# EAGLE design LOA_Legba (EAGLE 7.6.0)
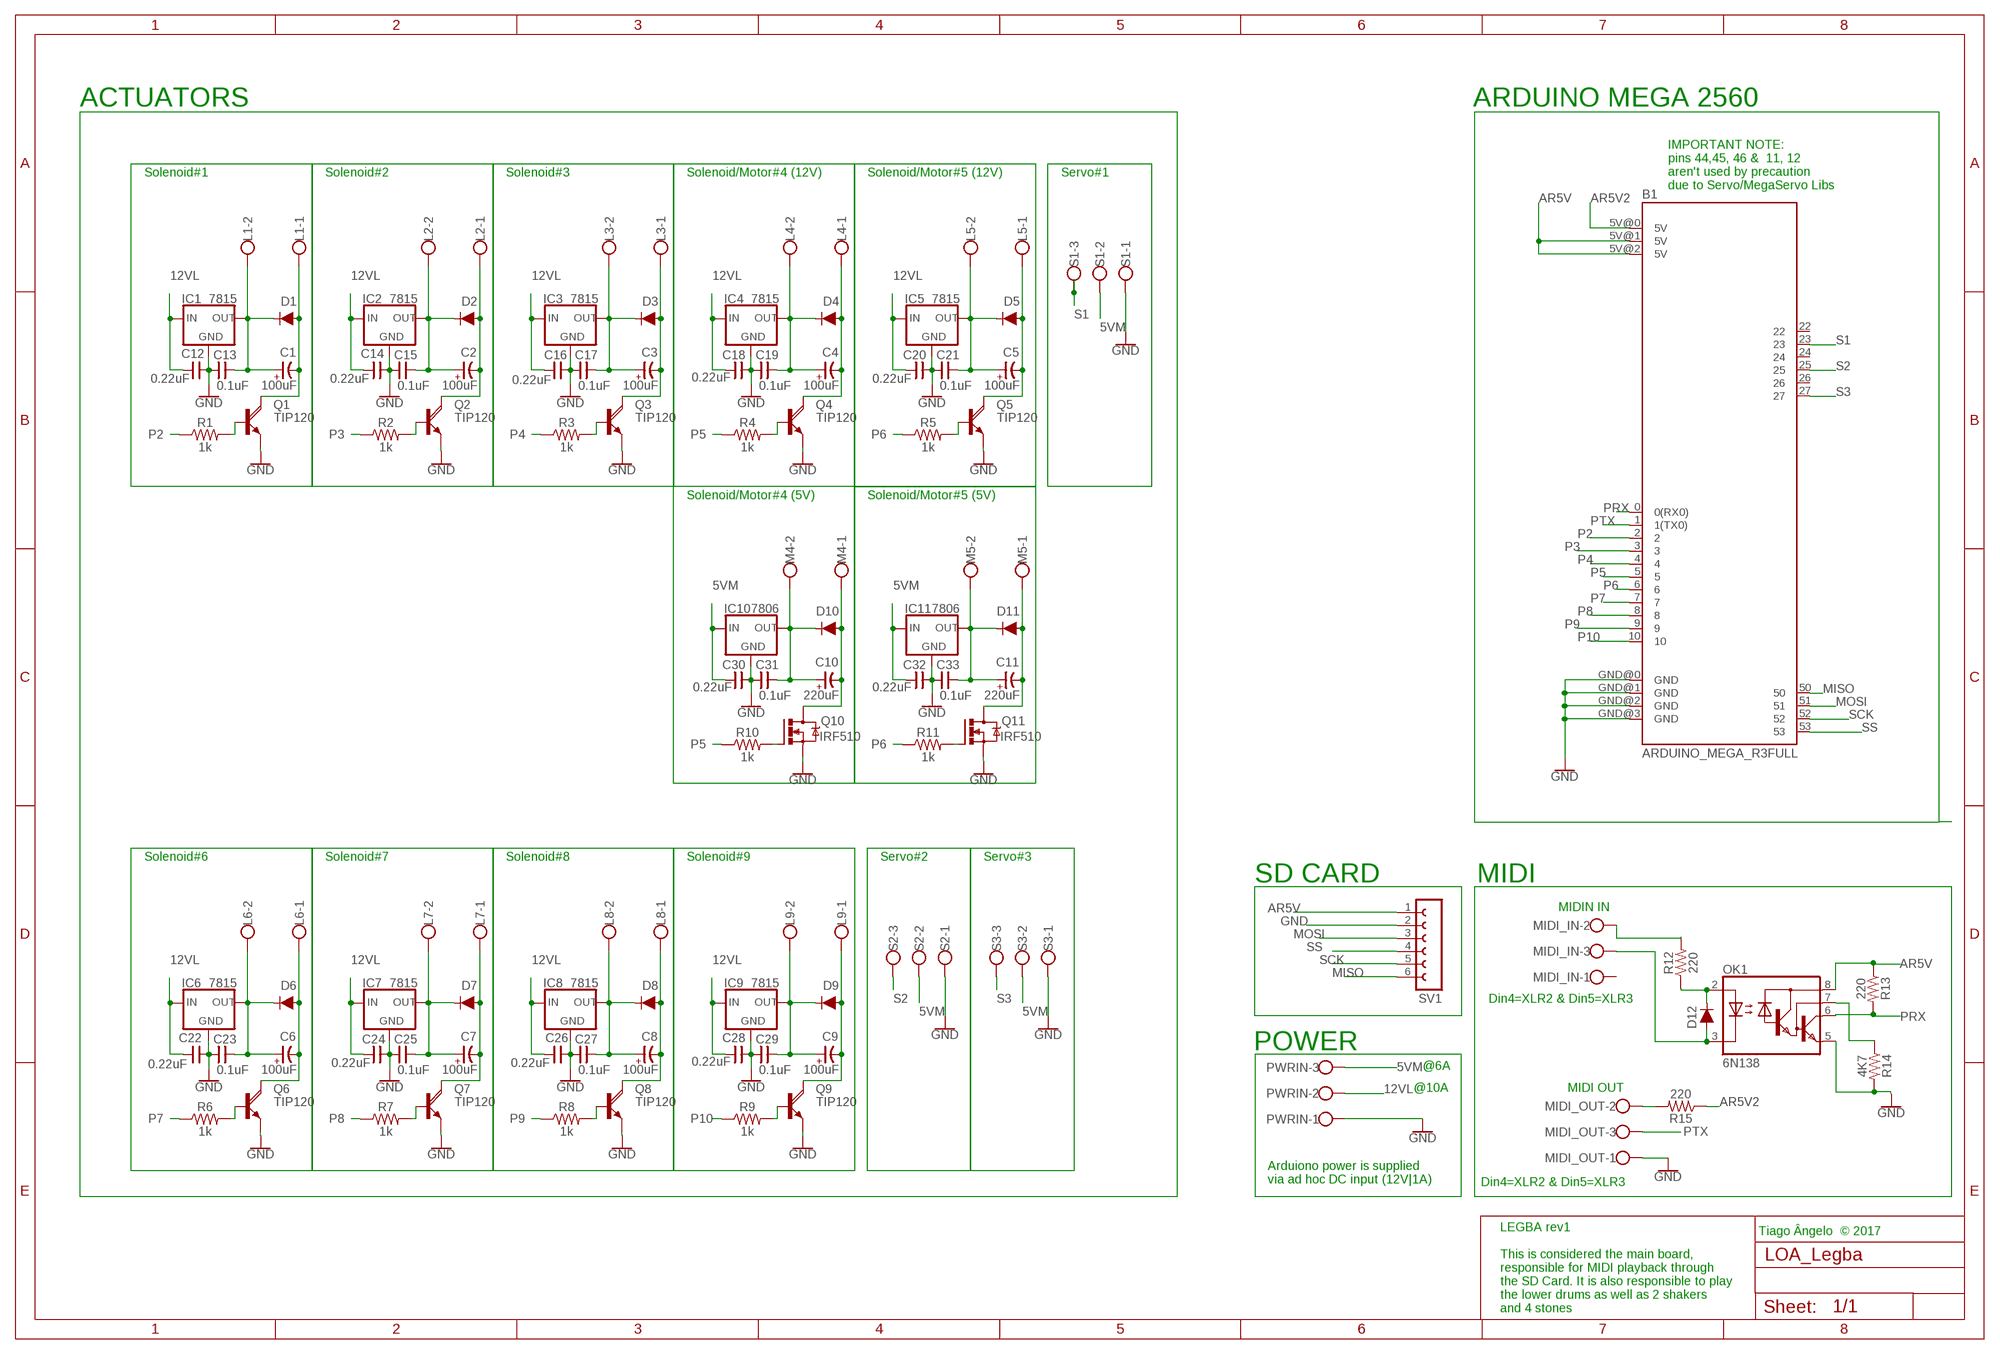
[diagram p0: schematic, sheet 1]

## Parts
B1  ARDUINO_MEGA_R3FULL  [ARDUINO_MEGA]
C1  100uF  CAP-MASTER_CP-E-020X050  [CAP-MASTER_E-020X050]
C2  100uF  CAP-MASTER_CP-E-020X050  [CAP-MASTER_E-020X050]
C3  100uF  CAP-MASTER_CP-E-020X050  [CAP-MASTER_E-020X050]
C4  100uF  CAP-MASTER_CP-E-020X050  [CAP-MASTER_E-020X050]
C5  100uF  CAP-MASTER_CP-E-020X050  [CAP-MASTER_E-020X050]
C6  100uF  CAP-MASTER_CP-E-020X050  [CAP-MASTER_E-020X050]
C7  100uF  CAP-MASTER_CP-E-020X050  [CAP-MASTER_E-020X050]
C8  100uF  CAP-MASTER_CP-E-020X050  [CAP-MASTER_E-020X050]
C9  100uF  CAP-MASTER_CP-E-020X050  [CAP-MASTER_E-020X050]
C10  220uF  CP-E-035X080  [E-035X080]
C11  220uF  CP-E-035X080  [E-035X080]
C12  0.22uF  CNP-C025-050X025  [C025-050X025]
C13  0.1uF  CNP-C025-050X025  [C025-050X025]
C14  0.22uF  CNP-C025-050X025  [C025-050X025]
C15  0.1uF  CNP-C025-050X025  [C025-050X025]
C16  0.22uF  CNP-C025-050X025  [C025-050X025]
C17  0.1uF  CNP-C025-050X025  [C025-050X025]
C18  0.22uF  CNP-C025-050X025  [C025-050X025]
C19  0.1uF  CNP-C025-050X025  [C025-050X025]
C20  0.22uF  CNP-C025-050X025  [C025-050X025]
C21  0.1uF  CNP-C025-050X025  [C025-050X025]
C22  0.22uF  CNP-C025-050X025  [C025-050X025]
C23  0.1uF  CNP-C025-050X025  [C025-050X025]
C24  0.22uF  CNP-C025-050X025  [C025-050X025]
C25  0.1uF  CNP-C025-050X025  [C025-050X025]
C26  0.22uF  CNP-C025-050X025  [C025-050X025]
C27  0.1uF  CNP-C025-050X025  [C025-050X025]
C28  0.22uF  CNP-C025-050X025  [C025-050X025]
C29  0.1uF  CNP-C025-050X025  [C025-050X025]
C30  0.22uF  CNP-C025-050X025  [C025-050X025]
C31  0.1uF  CNP-C025-050X025  [C025-050X025]
C32  0.22uF  CNP-C025-050X025  [C025-050X025]
C33  0.1uF  CNP-C025-050X025  [C025-050X025]
D1  1A/50V/1.1V  DIODE-KIT2  [DIODE-1N4001-KIT]
D2  1A/50V/1.1V  DIODE-KIT2  [DIODE-1N4001-KIT]
D3  1A/50V/1.1V  DIODE-KIT2  [DIODE-1N4001-KIT]
D4  1A/50V/1.1V  DIODE-KIT2  [DIODE-1N4001-KIT]
D5  1A/50V/1.1V  DIODE-KIT2  [DIODE-1N4001-KIT]
D6  1A/50V/1.1V  DIODE-KIT2  [DIODE-1N4001-KIT]
D7  1A/50V/1.1V  DIODE-KIT2  [DIODE-1N4001-KIT]
D8  1A/50V/1.1V  DIODE-KIT2  [DIODE-1N4001-KIT]
D9  1A/50V/1.1V  DIODE-KIT2  [DIODE-1N4001-KIT]
D10  1A/50V/1.1V  DIODE-KIT2  [DIODE-1N4001-KIT]
D11  1A/50V/1.1V  DIODE-KIT2  [DIODE-1N4001-KIT]
D12  200mA/100V/1V  DIODE-1N4148  [DIODE-1N4148]
IC1  7815  78XXS  [78XXS]
IC2  7815  78XXS  [78XXS]
IC3  7815  78XXS  [78XXS]
IC4  7815  78XXS  [78XXS]
IC5  7815  78XXS  [78XXS]
IC6  7815  78XXS  [78XXS]
IC7  7815  78XXS  [78XXS]
IC8  7815  78XXS  [78XXS]
IC9  7815  78XXS  [78XXS]
IC10  7806  78XXS  [78XXS]
IC11  7806  78XXS  [78XXS]
L1  W237-102  [W237-102]
L2  W237-102  [W237-102]
L3  W237-102  [W237-102]
L4  W237-102  [W237-102]
L5  W237-102  [W237-102]
L6  W237-102  [W237-102]
L7  W237-102  [W237-102]
L8  W237-102  [W237-102]
L9  W237-102  [W237-102]
M4  W237-102  [W237-102]
M5  W237-102  [W237-102]
MIDI_IN  W237-103  [W237-103]
MIDI_OUT  W237-103  [W237-103]
OK1  6N138  [DIL08]
PWRIN  W237-103  [W237-103]
Q1  TIP120  ROCKETFARM_TIP120V  [ROCKETFARM_TO220AV]
Q2  TIP120  ROCKETFARM_TIP120V  [ROCKETFARM_TO220AV]
Q3  TIP120  ROCKETFARM_TIP120V  [ROCKETFARM_TO220AV]
Q4  TIP120  ROCKETFARM_TIP120V  [ROCKETFARM_TO220AV]
Q5  TIP120  ROCKETFARM_TIP120V  [ROCKETFARM_TO220AV]
Q6  TIP120  ROCKETFARM_TIP120V  [ROCKETFARM_TO220AV]
Q7  TIP120  ROCKETFARM_TIP120V  [ROCKETFARM_TO220AV]
Q8  TIP120  ROCKETFARM_TIP120V  [ROCKETFARM_TO220AV]
Q9  TIP120  ROCKETFARM_TIP120V  [ROCKETFARM_TO220AV]
Q10  IRF510  IRF520  [TO220BV]
Q11  IRF510  IRF520  [TO220BV]
R1  1k  1KOHM-VERT-1/4W-1%  [AXIAL-0.1]
R2  1k  1KOHM-VERT-1/4W-1%  [AXIAL-0.1]
R3  1k  1KOHM-VERT-1/4W-1%  [AXIAL-0.1]
R4  1k  1KOHM-VERT-1/4W-1%  [AXIAL-0.1]
R5  1k  1KOHM-VERT-1/4W-1%  [AXIAL-0.1]
R6  1k  1KOHM-VERT-1/4W-1%  [AXIAL-0.1]
R7  1k  1KOHM-VERT-1/4W-1%  [AXIAL-0.1]
R8  1k  1KOHM-VERT-1/4W-1%  [AXIAL-0.1]
R9  1k  1KOHM-VERT-1/4W-1%  [AXIAL-0.1]
R10  1k  1KOHM-VERT-1/4W-1%  [AXIAL-0.1]
R11  1k  1KOHM-VERT-1/4W-1%  [AXIAL-0.1]
R12  220  1KOHM-HORIZ-1/4W-5%  [AXIAL-0.3]
R13  220  1KOHM-HORIZ-1/4W-5%  [AXIAL-0.3]
R14  4K7  1KOHM-HORIZ-1/4W-5%  [AXIAL-0.3]
R15  220  1KOHM-HORIZ-1/4W-5%  [AXIAL-0.3]
S1  W237-103  [W237-103]
S2  W237-103  [W237-103]
S3  W237-103  [W237-103]
SV1  FE06W  [FE06W]

## Nets
5VM [5VM]: C30.1 C32.1 IC10.IN IC11.IN PWRIN.3 S1.2 S2.2 S3.2
12VL [12VL]: C12.1 C14.1 C16.1 C18.1 C20.1 C22.1 C24.1 C26.1 C28.1 IC1.IN IC2.IN IC3.IN IC4.IN IC5.IN IC6.IN IC7.IN IC8.IN IC9.IN PWRIN.2
AR5V: B1.5V@1(5V) B1.5V@2(5V) OK1.8(VCC) R13.P$1 SV1.1
AR5V2: B1.5V@0(5V) R15.P$1
GND [GND]: B1.GND@0(GND) B1.GND@1(GND) B1.GND@2(GND) B1.GND@3(GND) C12.2 C13.1 C14.2 C15.1 C16.2 C17.1 C18.2 C19.1 C20.2 C21.1 C22.2 C23.1 C24.2 C25.1 C26.2 C27.1 C28.2 C29.1 C30.2 C31.1 C32.2 C33.1 IC1.GND IC2.GND IC3.GND IC4.GND IC5.GND IC6.GND IC7.GND IC8.GND IC9.GND IC10.GND IC11.GND MIDI_OUT.1 OK1.5(GND) PWRIN.1 Q1.E Q2.E Q3.E Q4.E Q5.E Q6.E Q7.E Q8.E Q9.E Q10.S Q11.S R14.P$2 S1.1 S2.1 S3.1 SV1.2
L1-1: C1.- D1.A L1.1 Q1.C
L1-2: C1.+ C13.2 D1.C IC1.OUT L1.2
L2-1: C2.- D2.A L2.1 Q2.C
L2-2: C2.+ C15.2 D2.C IC2.OUT L2.2
L3-1: C3.- D3.A L3.1 Q3.C
L3-2: C3.+ C17.2 D3.C IC3.OUT L3.2
L4-1: C4.- D4.A L4.1 Q4.C
L4-2: C4.+ C19.2 D4.C IC4.OUT L4.2
L5-1: C5.- D5.A L5.1 Q5.C
L5-2: C5.+ C21.2 D5.C IC5.OUT L5.2
L6-1: C6.- D6.A L6.1 Q6.C
L6-2: C6.+ C23.2 D6.C IC6.OUT L6.2
L7-1: C7.- D7.A L7.1 Q7.C
L7-2: C7.+ C25.2 D7.C IC7.OUT L7.2
L8-1: C8.- D8.A L8.1 Q8.C
L8-2: C8.+ C27.2 D8.C IC8.OUT L8.2
L9-1: C9.- D9.A L9.1 Q9.C
L9-2: C9.+ C29.2 D9.C IC9.OUT L9.2
M4-1: C10.- D10.A M4.1 Q10.D
M4-2: C10.+ C31.2 D10.C IC10.OUT M4.2
M5-1: C11.- D11.A M5.1 Q11.D
M5-2: C11.+ C33.2 D11.C IC11.OUT M5.2
MISO: B1.50 SV1.6
MOSI: B1.51 SV1.3
N$1: Q10.G R10.P$2
N$2: MIDI_OUT.2 R15.P$2
N$3: Q2.B R2.P$2
N$4: Q3.B R3.P$2
N$5: Q4.B R4.P$2
N$8: Q5.B R5.P$2
N$10: Q11.G R11.P$2
N$13: Q6.B R6.P$2
N$14: Q7.B R7.P$2
N$15: Q8.B R8.P$2
N$16: Q1.B R1.P$2
N$17: Q9.B R9.P$2
N$25: D12.A MIDI_IN.3 OK1.3(C)
N$26: D12.C OK1.2(A) R12.P$1
N$27: MIDI_IN.2 R12.P$2
N$29: OK1.7(VB) R14.P$1
P2: B1.2 R1.P$1
P3: B1.3 R2.P$1
P4: B1.4 R3.P$1
P5: B1.5 R4.P$1 R10.P$1
P6: B1.6 R5.P$1 R11.P$1
P7: B1.7 R6.P$1
P8: B1.8 R7.P$1
P9: B1.9 R8.P$1
P10: B1.10 R9.P$1
PRX: B1.0(0(RX0)) OK1.6(VO) R13.P$2
PTX: B1.1(1(TX0)) MIDI_OUT.3
S1: B1.23 S1.3
S2: B1.25 S2.3
S3: B1.27 S3.3
SCK: B1.52 SV1.5
SS: B1.53 SV1.4
Unconnected: B1.22 B1.24 B1.26 MIDI_IN.1

## Notes on the sheet
- ACTUATORS | ARDUINO MEGA 2560
- Solenoid#1 | Solenoid#2 | Solenoid#3 | Solenoid/Motor#4 (12V) | Solenoid/Motor#5 (12V) | Servo#1
- IMPORTANT NOTE:
  pins 44,45, 46 &  11, 12 
  aren't used by precaution
  due to Servo/MegaServo Libs
- Solenoid/Motor#4 (5V) | Solenoid/Motor#5 (5V)
- Solenoid#6 | Solenoid#7 | Solenoid#8 | Solenoid#9 | Servo#2 | Servo#3
- SD CARD | MIDI
- MIDIN IN
- Din4=XLR2 & Din5=XLR3
- POWER
- @6A
- MIDI OUT
- @10A
- Din4=XLR2 & Din5=XLR3
- Arduiono power is supplied
  via ad hoc DC input (12V|1A)
- Tiago Ângelo  © 2017
- LEGBA rev1
  
  This is considered the main board,
  responsible for MIDI playback through 
  the SD Card. It is also responsible to play
  the lower drums as well as 2 shakers
  and 4 stones

## Library data of the parts
B1 = LOA-Boards:ARDUINO_MEGA_R3: Arduino Mega R3 ATmega2560 R3 compatible footprint. SparkFun Products: Arduino Mega 2560 R3 <https://www.sparkfun.com/products/11061>
C1-C9 = PHOBOS-lbr:CAP-MASTER_CP-: POLARIZED CAP
C10 C11 = cap-master:CP-: POLARIZED CAP
C12-C33 = cap-master:CNP-: NON-POLARIZED CAP
D1-D11 = SparkFun-DiscreteSemi:DIODE: Diode These are standard reverse protection diodes and small signal diodes. SparkFun Products: SparkFun SparkPunk Sound Kit <https://www.sparkfun.com/products/11177> SparkFun ESP8266 Thing <https://www.sparkfun.com/products/13231>; PROD_ID: DIO-09176
D12 = SparkFun-DiscreteSemi:DIODE: Diode These are standard reverse protection diodes and small signal diodes. SparkFun Products: SparkFun SparkPunk Sound Kit <https://www.sparkfun.com/products/11177> SparkFun ESP8266 Thing <https://www.sparkfun.com/products/13231>; PROD_ID: DIO-08378
IC1-IC11 = v-reg:78XXS: VOLTAGE REGULATOR
L1-L9 M4 M5 = con-wago-500:W237-102: WAGO SCREW CLAMP; MPN: 237-102; OC_FARNELL: unknown; OC_NEWARK: 70K9898
MIDI_IN MIDI_OUT PWRIN S1-S3 = con-wago-500:W237-103: WAGO SCREW CLAMP; MPN: 237-103; OC_FARNELL: unknown; OC_NEWARK: 18M7116
OK1 = optocoupler:6N138: MOTOROLA OPTO COUPLER; MF: VISHAY/TELEFUNKEN; MPN: 6N138; OC_FARNELL: 9860150; OC_NEWARK: 35K5294
Q1-Q9 = PHOBOS-lbr:ROCKETFARM_TIP120: NPN DARLINGTON TRANSISTOR
Q10 Q11 = transistor-power:IRF520: HEXFET Power MOSFET
R1-R11 = SparkFun-Resistors:1KOHM: 1kΩ resistor A resistor is a passive two-terminal electrical component that implements electrical resistance as a circuit element. Resistors act to reduce current flow, and, at the same time, act to lower voltage levels within circuits. - Wikipedia; PROD_ID: RES-12182
R12-R15 = SparkFun-Resistors:1KOHM: 1kΩ resistor A resistor is a passive two-terminal electrical component that implements electrical resistance as a circuit element. Resistors act to reduce current flow, and, at the same time, act to lower voltage levels within circuits. - Wikipedia; PROD_ID: RES-08380; VALUE: 1k
SV1 = con-lsta:FE06W: FEMALE HEADER

## Net classes
0 default: width 0.508 mm, drill 0.508 mm, clearance 0.508 mm
1 GND: width 0.508 mm, drill 0.508 mm, clearance 0.508 mm
2 5VM: width 0.508 mm, drill 0.508 mm, clearance 0.508 mm
3 12VL: width 0.508 mm, drill 0.508 mm, clearance 0.508 mm
4 12VA: width 0.508 mm, drill 0.508 mm, clearance 0.508 mm

## Board
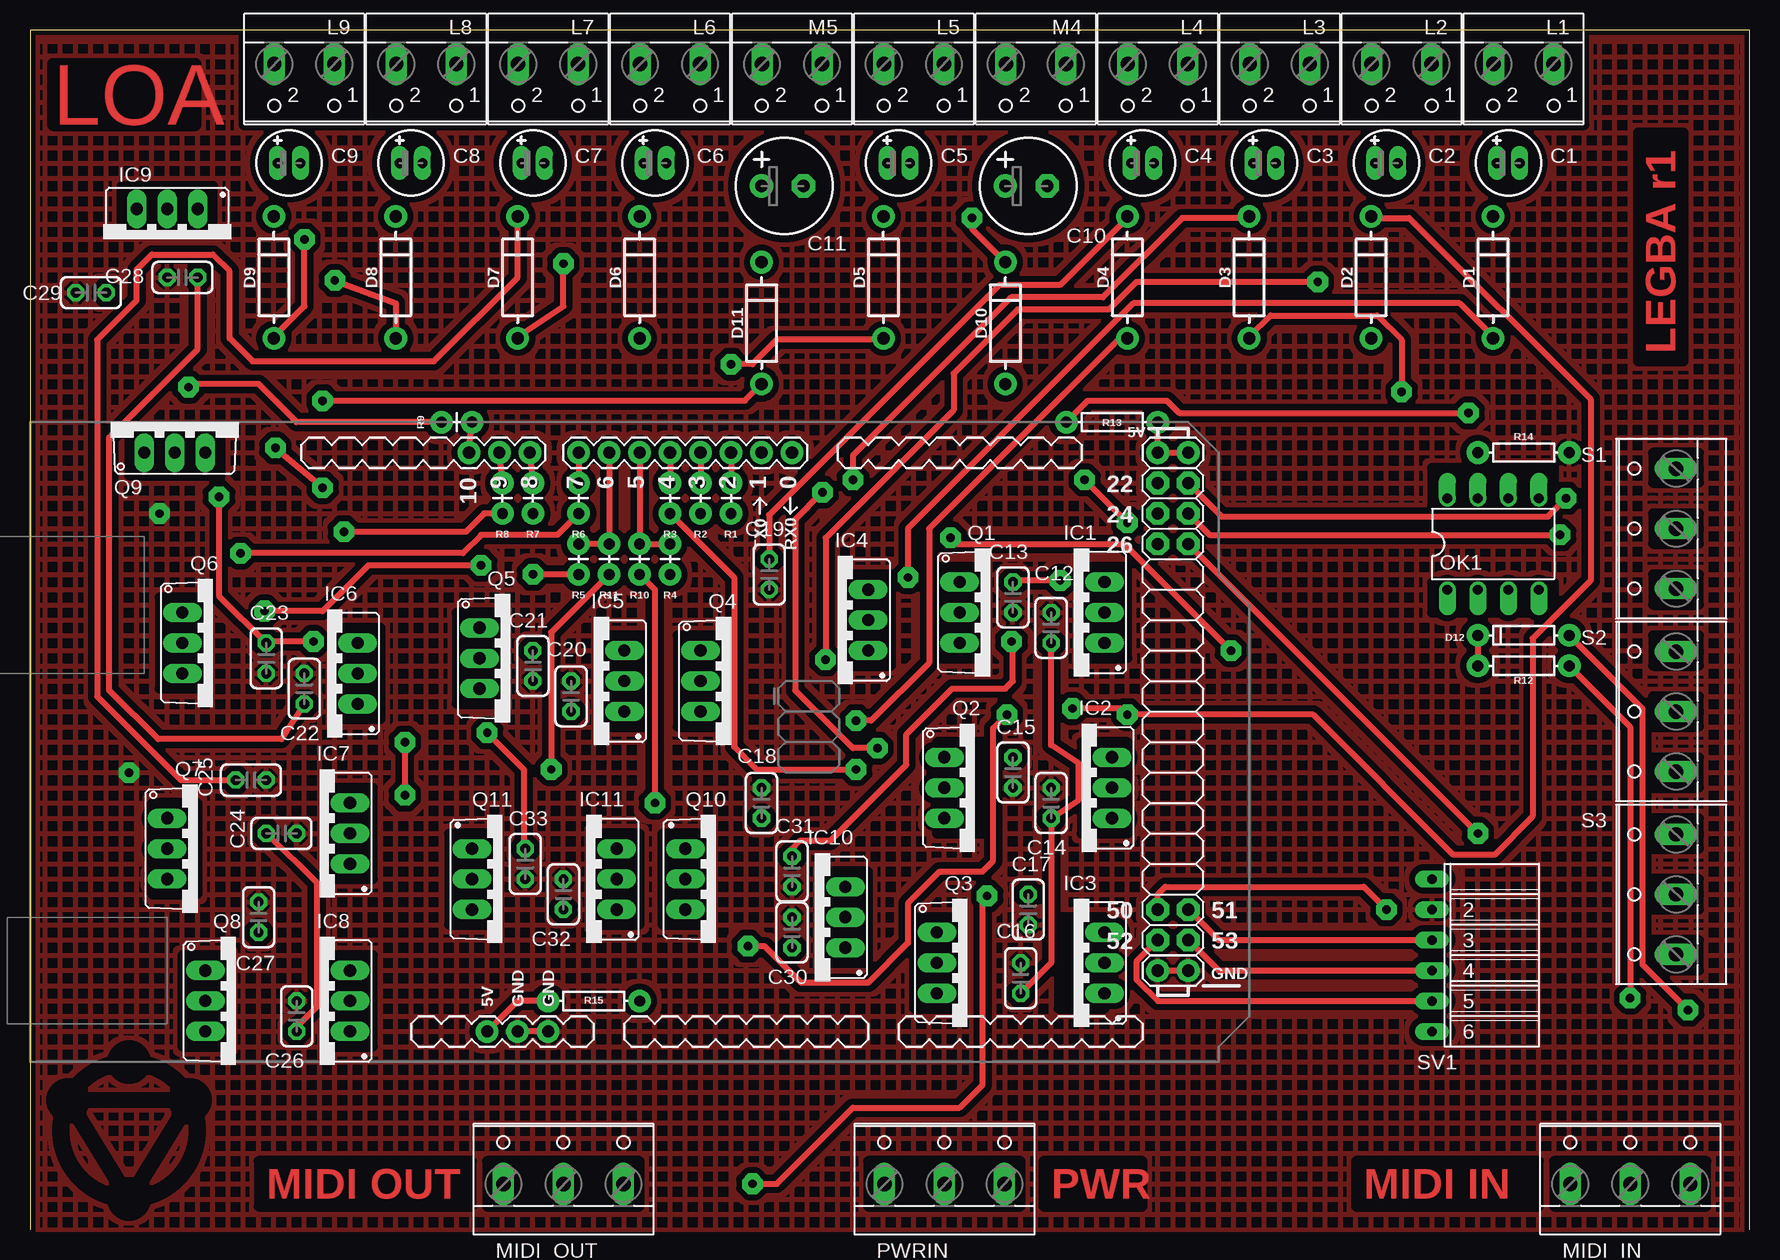
[diagram p1: board, top side]
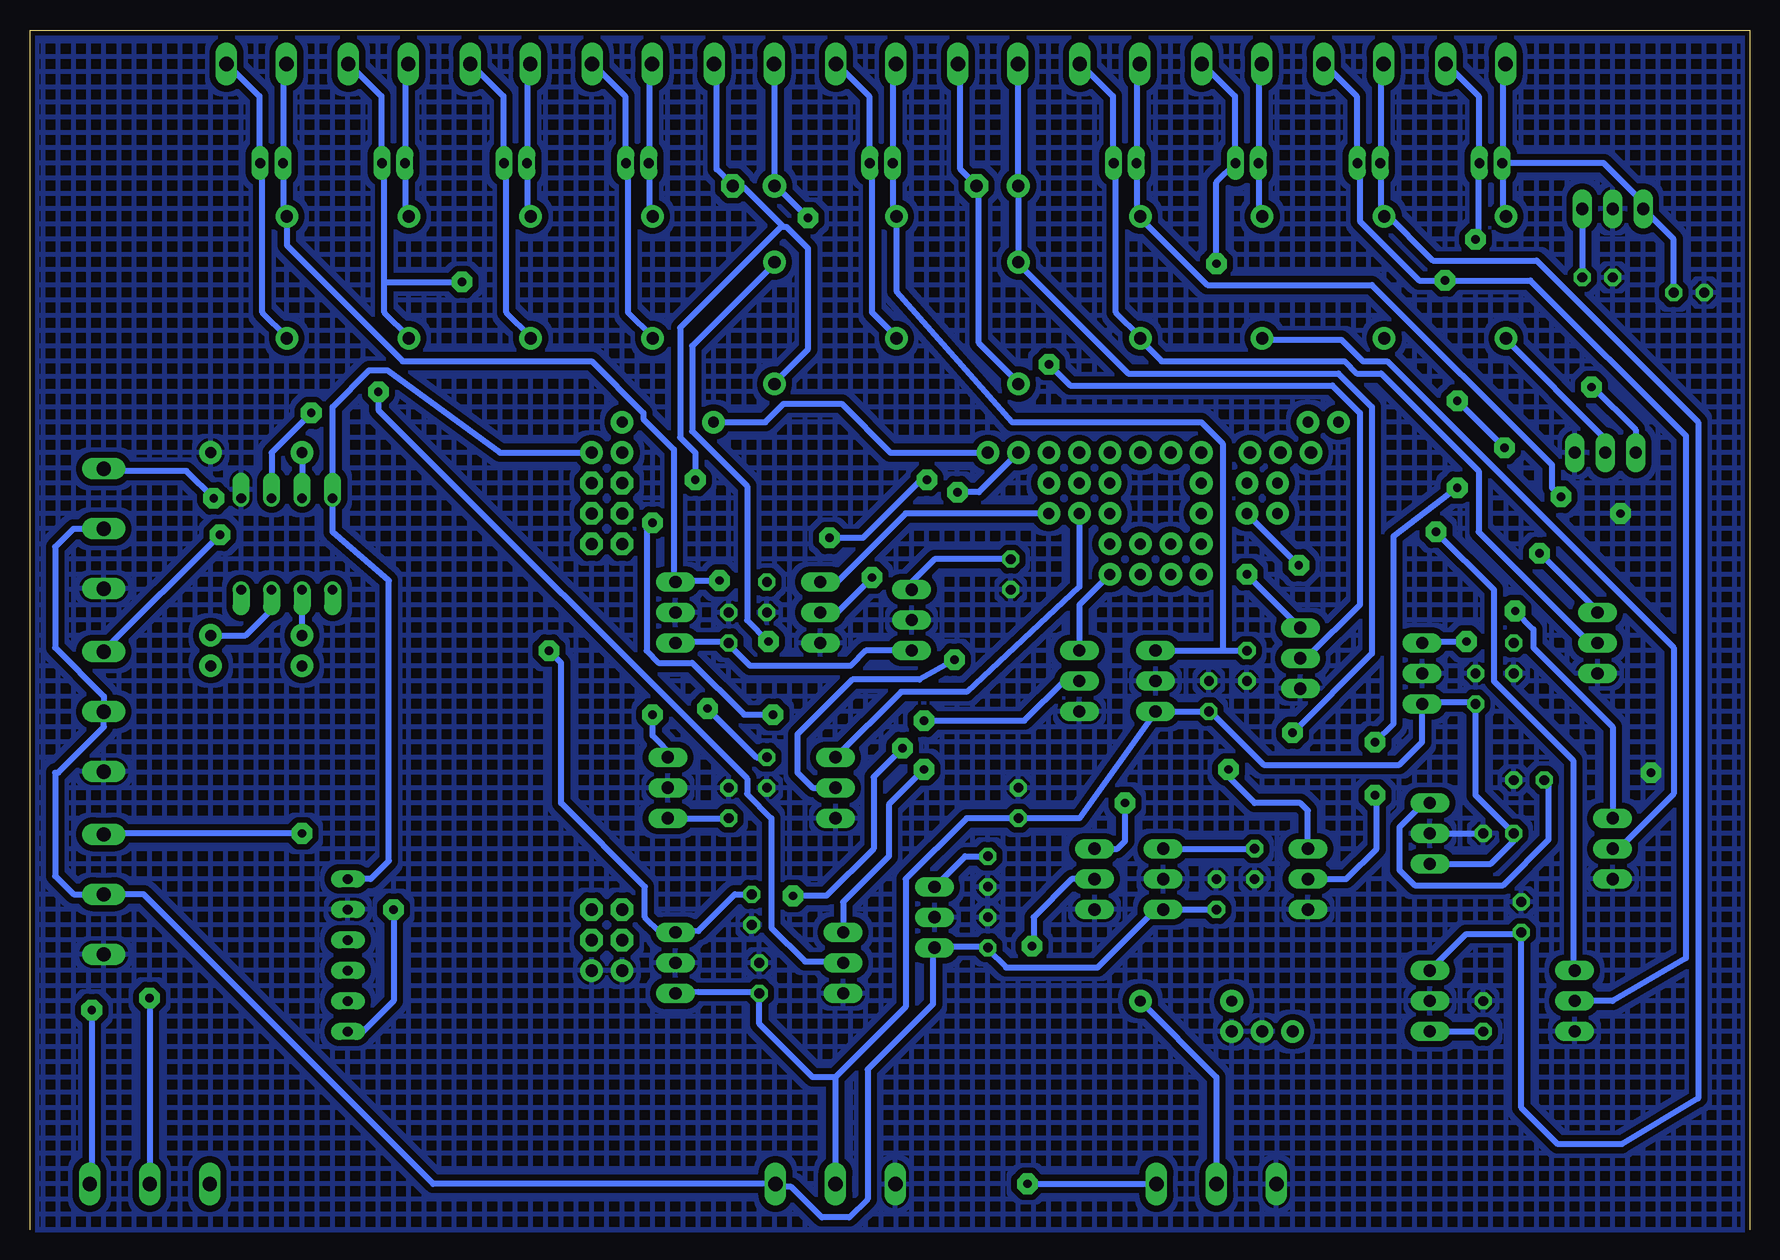
[diagram p2: board, bottom side, seen from below]

Size 143.32 x 100 mm. Coordinates in mm from the lower left corner, seen from the top.
Outline: 143.32,0 143.32,100 0,100 0,0
Copper layers (1*16): Top 0.035mm / dielectric 1.5mm / Bottom 0.035mm
Design rules "Dek": minimum track width 12mil, minimum drill 36mil, track to track 12mil, track to pad 12mil, pad to pad 12mil, via to via 12mil, smd to smd 0mil, copper to edge 10mil, drill to drill 12mil, minimum pad ring 12mil, minimum via ring 20mil, stop-mask expansion 4mil, vias tented up to drill 25mil, thermal gap 10mil
tRestrict: area 18.8,86.1 to 24.4,91.7; area 28.9,86.1 to 34.6,91.7; area 39.1,86.1 to 44.7,91.7; area 49.2,86.1 to 54.9,91.7; area 69.6,86.1 to 75.2,91.7; area 89.9,86.1 to 95.5,91.7; area 100,86.1 to 105.7,91.7; area 110.2,86.1 to 115.9,91.7; area 120.4,86.1 to 126,91.7; area 58.6,82.7 to 67.1,91.3; area 78.9,82.7 to 87.4,91.3; area 17.8,92.1 to 129.5,101.6; 45 more areas; 3 lines
vRestrict: area 19.1,75.6 to 21.6,83.2; area 29.2,75.6 to 31.8,83.2; area 39.4,75.6 to 41.9,83.2; area 49.5,75.6 to 52.1,83.2; area 59.7,71.8 to 62.2,79.4; area 69.8,75.6 to 72.4,83.2; area 90.2,75.6 to 92.7,83.2; area 80,71.8 to 82.5,79.4; area 100.3,75.6 to 102.9,83.2; area 110.5,75.6 to 113,83.2; area 120.7,75.6 to 123.2,83.2; area 22.2,63.5 to 35.6,66; 19 more areas

### Footprints (pad centres in the part's own frame; a part is rotated, then mirrored left to right if it is on the bottom)
ARDUINO_MEGA = drill 1.016 pad 1.88: 0 13.97,24.13; 1 11.43,24.13; 2 8.89,24.13; 3 6.35,24.13; 4 3.81,24.13; 5 1.27,24.13; 5V@0 -11.43,-24.13; 5V@1 44.45,24.13; 5V@2 46.99,24.13; 6 -1.27,24.13; 7 -3.81,24.13; 8 -7.874,24.13; 9 -10.414,24.13; 10 -12.954,24.13; GND@0 -8.89,-24.13; GND@1 -6.35,-24.13; GND@2 44.45,-19.05; GND@3 46.99,-19.05 | drill 1.016 pad 1.88 octagon: 22 44.45,21.59; 23 46.99,21.59; 24 44.45,19.05; 25 46.99,19.05; 26 44.45,16.51; 27 46.99,16.51; 50 44.45,-13.97; 51 46.99,-13.97; 52 44.45,-16.51; 53 46.99,-16.51
CAP-MASTER_E-020X050 = drill 0.813 long: + -0.953,0; - 0.953,0
E-035X080 = drill 1.016 pad 1.93: + -1.905,0 | drill 1.016 pad 1.93 octagon: - 1.587,0
C025-050X025 = drill 0.813 pad 1.422 octagon: 1 -1.27,0; 2 1.27,0
DIODE-1N4001-KIT = drill 1.016 pad 1.88: A -5.08,0; C 5.08,0
DIODE-1N4148 = drill 0.9 pad 1.88: A -3.81,0; C 3.81,0
78XXS = drill 1.016 long: GND 0,-2.54; IN -2.54,-2.54; OUT 2.54,-2.54
W237-102 = drill 1.194 long: 1 -2.5,-1.27; 2 2.5,-1.27
W237-103 = drill 1.194 long: 1 -5,-1.29; 2 0,-1.29; 3 5,-1.29
DIL08 = drill 0.813 offset: 1 -3.81,-3.81; 2 -1.27,-3.81; 3 1.27,-3.81; 4 3.81,-3.81; 5 3.81,3.81; 6 1.27,3.81; 7 -1.27,3.81; 8 -3.81,3.81
ROCKETFARM_TO220AV = drill 1.016 long: B -2.54,-2.54; C 0,-2.54; E 2.54,-2.54
TO220BV = drill 1.016 long: D 0,-2.54; G -2.54,-2.54; S 2.54,-2.54
AXIAL-0.1 = drill 0.9 pad 1.88: P$1 -1.27,0; P$2 1.27,0
AXIAL-0.3 = drill 0.9 pad 1.88: P$1 -3.81,0; P$2 3.81,0
FE06W = drill 0.813 long: 1 -6.35,0; 2 -3.81,0; 3 -1.27,0; 4 1.27,0; 5 3.81,0; 6 6.35,0

### Placement (x,y rotation side)
B1  49.53,40.64 0 top
C1  123.19,88.9 0 top
C2  113.03,88.9 0 top
C3  102.87,88.9 0 top
C4  92.71,88.9 0 top
C5  72.39,88.9 0 top
C6  52.07,88.9 0 top
C7  41.91,88.9 0 top
C8  31.75,88.9 0 top
C9  21.59,88.9 0 top
C10  83.19,87 0 top
C11  62.87,87 0 top
C12  85.09,50.16 90 top
C13  81.92,52.7 90 top
C14  85.09,35.56 90 top
C15  81.92,38.1 90 top
C16  82.55,20.95 90 top
C17  83.19,26.67 90 top
C18  60.96,35.56 90 top
C19  61.59,54.61 90 top
C20  45.09,44.45 90 top
C21  41.91,46.99 90 top
C22  22.86,45.09 90 top
C23  19.68,47.62 90 top
C24  20.95,33.02 0 top
C25  18.41,37.47 180 top
C26  22.23,17.78 90 top
C27  19.05,26.04 270 top
C28  12.7,79.38 180 top
C29  5.08,78.11 0 top
C30  63.5,24.77 90 top
C31  63.5,29.84 90 top
C32  44.45,27.94 90 top
C33  41.27,30.48 90 top
D1  121.92,79.38 90 top
D2  111.76,79.38 90 top
D3  101.6,79.38 90 top
D4  91.44,79.38 90 top
D5  71.12,79.38 90 top
D6  50.8,79.38 90 top
D7  40.64,79.38 90 top
D8  30.48,79.38 90 top
D9  20.32,79.38 90 top
D10  81.28,75.56 90 top
D11  60.96,75.56 90 top
D12  124.46,49.53 180 top
IC1  87,51.44 90 top
IC2  87.63,36.83 90 top
IC3  87,22.23 90 top
IC4  67.31,50.8 90 top
IC5  46.99,45.72 90 top
IC6  24.77,46.35 90 top
IC7  24.13,33.02 90 top
IC8  24.13,19.05 90 top
IC9  11.43,82.55 180 top
IC10  65.41,26.04 90 top
IC11  46.35,29.21 90 top
L1  124.46,95.89 180 top
L2  114.3,95.89 180 top
L3  104.14,95.89 180 top
L4  93.98,95.89 180 top
L5  73.66,95.89 180 top
L6  53.34,95.89 180 top
L7  43.18,95.89 180 top
L8  33.02,95.89 180 top
L9  22.86,95.89 180 top
M4  83.82,95.89 180 top
M5  63.5,95.89 180 top
MIDI_IN  133.35,5.08 0 top
MIDI_OUT  44.45,5.08 0 top
OK1  121.92,57.15 0 top
PWRIN  76.2,5.08 0 top
Q1  80.01,51.44 270 top
Q2  78.74,36.83 270 top
Q3  78.11,22.23 270 top
Q4  58.42,45.72 270 top
Q5  40.01,47.62 270 top
Q6  15.24,48.9 270 top
Q7  13.97,31.75 270 top
Q8  17.14,19.05 270 top
Q9  12.06,67.31 0 top
Q10  57.15,29.21 270 top
Q11  39.37,29.21 270 top
R1  58.42,60.96 270 top
R2  55.88,60.96 270 top
R3  53.34,60.96 270 top
R4  53.34,55.88 270 top
R5  45.72,55.88 270 top
R6  45.72,60.96 270 top
R7  41.91,60.96 270 top
R8  39.37,60.96 270 top
R9  35.56,67.31 180 top
R10  50.8,55.88 270 top
R11  48.26,55.88 270 top
R12  124.46,46.99 0 top
R13  90.17,67.31 180 top
R14  124.46,64.77 0 top
R15  46.99,19.05 0 top
S1  135.89,58.42 90 top
S2  135.89,43.18 90 top
S3  135.89,27.94 90 top
SV1  116.84,22.86 270 top

### Tracks (layer width: path | path; a pad name or v marks a point on that pad's centre or on a via)
5VM
  Bottom 0.508: 137.41,27.94 S3.2 | 137.41,58.42 S1.2 139.7,58.42 141.22,56.9 141.22,48.51 137.16,44.45 137.16,43.2 S2.2 137.16,43.16 137.16,41.91 140.97,38.1 141.22,38.1 141.22,29.46 139.7,27.94 S3.2 | C32.1 IC11.IN 49.53,26.67 54.36,21.84 61.98,21.84 63.5,23.37 C30.1 63.5,23.62 67.82,23.62 IC10.IN 68.07,23.37 68.07,18.8 73.53,13.34 73.53,2.54 75.06,1.02 77.34,1.02 79.88,3.56 81.03,3.56 PWRIN.3 81.28,3.81 109.73,3.81 133.86,27.94 S3.2
12VL
  Top 0.508: C12.1 85.09,40.39 87.38,38.86 87.38,35.81 C14.1 85.09,22.23 C16.1 | C26.1 22.35,16.51 22.35,17.02 23.88,18.54 23.88,28.96 22.35,30.48 C24.1 | C28.1 13.97,73.41 6.6,66.04 6.6,44.96 10.67,40.89 20.95,40.89 C22.1 22.86,43.69
  Bottom 0.508: IC1.IN 89.41,49.02 85.09,49.02 C12.1 85.09,48.77 83.31,46.99 74.93,46.99 73.66,48.26 IC4.IN | IC2.IN C14.1 | IC3.IN 87.63,19.81 83.31,19.81 C16.1 82.55,17.14 78.11,12.7 76.2,12.7 | IC9.IN C28.1 | IC8.IN C26.1 | IC7.IN 21.59,30.48 19.68,32.38 C24.1 22.86,36.2 C22.1 22.86,43.94 27.18,43.94 IC6.IN 27.3,40.64 29.21,38.73 40.51,38.73 44.96,43.18 C20.1 IC5.IN 55.88,34.29 C18.1 65.28,34.29 70.36,29.21 70.36,18.54 76.2,12.7 | 76.2,12.7 PWRIN.2
AR5V
  Top 0.508: B1.5V@2 B1.5V@1 R13.P$1
  Bottom 0.508: B1.5V@2 104.14,64.77 113.54,71.63 115.06,71.63 118.11,68.58 OK1.8 118.11,58.17 113.41,54.1 113.41,30.73 114.94,29.21 SV1.1
AR5V2
  Top 0.508: B1.5V@0 40.64,19.05 R15.P$1
GND  (via drill 0.7)
  Top 0.508: B1.GND@1 B1.GND@0 | B1.GND@2 B1.GND@3
  Bottom 0.508: IC7.GND C24.2
  other vias: 8.26,38.1 10.79,59.69
  pour Bottom (isolate 0.406, hatched): 0,100.33 143.51,100.33 143.51,0 0,0
  pour Top (isolate 0.406, hatched): 0,100.33 143.51,100.33 143.51,0 0,0
L1-1  (via drill 0.7)
  Top 0.508: v73.15,54.36 73.15,58.42 91.95,77.22 119.13,77.22 121.92,74.42 D1.A
  Bottom 0.508: L1.1 126.75,97.03 124.21,94.49 124.21,88.9 C1.- 123.95,88.9 123.95,76.45 121.92,74.42 D1.A | v73.15,54.36 75.95,51.56 77.47,51.56 Q1.C
L1-2  (via drill 0.7)
  Top 0.508: v85.85,54.1 82.04,54.1 C13.2
  Bottom 0.508: v85.85,54.1 89.41,54.1 IC1.OUT 89.66,54.1 89.66,65.02 92.2,67.56 92.2,68.07 96.52,72.39 112.27,72.39 121.92,82.04 D1.C 121.92,84.58 122.17,84.84 122.17,88.9 | 122.17,88.9 122.17,97.03 L1.2 | 122.17,88.9 C1.+
L2-1  (via drill 0.7)
  Top 0.508: v66.29,47.5 66.29,57.66 76.96,68.33 76.96,71.37 82.3,76.71 89.92,76.71 92.2,78.99 v107.31,78.99
  Bottom 0.508: L2.1 116.59,97.03 114.05,94.49 114.05,88.9 C2.- 113.79,88.9 113.79,78.99 | 113.79,78.99 113.79,76.45 111.76,74.42 D2.A | v66.29,47.5 69.22,45.85 74.8,45.85 79.38,41.27 79.38,38.1 78.11,36.83 Q2.C | 113.79,78.99 v107.31,78.99
L2-2  (via drill 0.7)
  Top 0.508: v86.87,43.43 90.93,43.43 v91.44,42.93 106.93,42.93 118.62,31.24 122.05,31.24 125.22,34.42 125.22,49.28 130.05,54.1 130.05,69.22 114.94,84.33 111.76,84.33 D2.C
  Bottom 0.508: C15.2 82.8,39.37 v86.87,43.43 | v91.44,42.93 91.44,41.15 89.66,39.37 IC2.OUT | 112.01,88.9 112.01,84.84 111.76,84.58 D2.C | 112.01,88.9 112.01,97.03 L2.2 | 112.01,88.9 C2.+
L3-1  (via drill 0.7)
  Top 0.508: v114.3,69.85 114.3,74.17 112.27,76.2 103.38,76.2 101.6,74.42 D3.A
  Bottom 0.508: L3.1 106.43,97.03 103.89,94.49 103.89,88.9 C3.- 103.63,88.9 103.63,76.45 101.6,74.42 D3.A | v114.3,69.85 114.3,68.33 83.57,37.59 83.57,36.32 81.53,34.29 81.53,25.15 78.74,22.35 75.69,22.35 Q3.C
L3-2  (via drill 0.7)
  Top 0.508: v100.08,48.26 91.19,57.15 77.22,57.15 v76.71,57.66 | v68.58,62.48 68.58,64.52 81.79,77.72 89.41,77.72 96.01,84.33 101.6,84.33 D3.C
  Bottom 0.508: C17.2 84.58,27.94 87.63,24.89 IC3.OUT 90.81,24.77 92.08,26.04 92.08,28.57 99.06,35.56 99.06,47.24 v100.08,48.26 | 101.85,88.9 101.85,84.84 101.6,84.58 D3.C | 101.85,88.9 101.85,97.03 L3.2 | 101.85,88.9 C3.+ | v76.71,57.66 73.91,57.66 69.09,62.48 v68.58,62.48
L4-1  (via drill 0.7)
  Top 0.508: v68.83,42.42 70.1,42.42 74.93,47.24 74.93,58.42 90.68,74.17 91.44,74.17 D4.A
  Bottom 0.508: L4.1 96.27,97.03 93.73,94.49 93.73,88.9 C4.- 93.47,88.9 93.47,76.45 91.44,74.42 D4.A | Q4.C 57.15,45.72 60.45,42.42 v68.83,42.42
L4-2
  Top 0.508: C19.2 61.59,59.56 80.77,78.74 85.85,78.74 91.44,84.33 D4.C
  Bottom 0.508: 91.69,88.9 91.69,84.84 91.44,84.58 D4.C | 91.69,88.9 91.69,97.03 L4.2 | 91.69,88.9 C4.+ | C19.2 67.94,55.88 69.85,53.98 IC4.OUT
L5-1  (via drill 0.7)
  Top 0.508: v58.42,72.14 60.2,72.14 62.23,74.17 71.12,74.17 D5.A
  Bottom 0.508: L5.1 75.95,97.03 73.41,94.49 73.41,88.9 C5.- 73.15,88.9 73.15,76.45 71.12,74.42 D5.A | v58.42,72.14 56.64,70.36 34.8,70.36 32.51,68.07 32.51,52.07 36.83,47.75 37.34,47.75 Q5.C
L5-2
  Bottom 0.508: IC5.OUT 43.94,48.26 | 43.94,48.26 C21.2 | 71.37,88.9 71.37,84.84 71.12,84.58 D5.C 71.12,78.23 61.47,67.31 45.72,67.31 43.94,65.53 43.94,48.26 | 71.37,88.9 71.37,97.03 L5.2 | 71.37,88.9 C5.+
L6-1
  Bottom 0.508: L6.1 55.63,97.03 53.09,94.49 53.09,88.9 C6.- 52.83,88.9 52.83,76.45 50.8,74.42 D6.A 50.8,74.17 49.02,72.39 33.78,72.39 32.77,71.37 30.73,71.37 22.61,63.25 22.61,58.17 13.46,49.02 12.7,49.02 Q6.C
L6-2  (via drill 0.7)
  Top 0.508: v23.62,49.02 19.81,49.02 C23.2 15.75,52.83 v15.75,61.09
  Bottom 0.508: v23.62,49.02 27.18,49.02 IC6.OUT | 51.05,88.9 51.05,84.84 50.8,84.58 D6.C 50.8,84.33 45.21,78.74 31.5,78.74 16.51,63.75 16.51,61.85 v15.75,61.09 | 51.05,88.9 51.05,97.03 L6.2 | 51.05,88.9 C6.+
L7-1  (via drill 0.7)
  Top 0.508: v44.45,80.52 44.45,76.96 40.64,74.42 D7.A
  Bottom 0.508: L7.1 45.47,97.03 42.93,94.49 42.93,88.9 C7.- 44.45,87.31 v44.45,80.52 | Q7.C 10.92,31.75 6.35,36.32 6.35,48.51 30.23,72.39 32.26,72.39 34.04,74.17 40.64,74.17 D7.A
L7-2
  Top 0.508: C25.2 12.57,37.47 5.59,44.45 5.59,74.17 8.89,77.47 8.89,80.01 10.16,81.28 15.24,81.28 16.64,79.88 16.64,74.3 18.54,72.39 33.66,72.39 40.64,79.38 D7.C
  Bottom 0.508: C25.2 16.76,37.21 16.76,32.51 20.57,28.7 27.94,28.7 29.21,29.97 29.21,33.53 27.18,35.56 IC7.OUT | 40.89,88.9 40.89,84.84 40.64,84.58 D7.C | 40.89,88.9 40.89,97.03 L7.2 | 40.89,88.9 C7.+
L8-1  (via drill 0.7)
  Top 0.508: D8.A 30.48,77.22 v25.4,79.12
  Bottom 0.508: L8.1 35.31,97.03 32.77,94.49 32.77,88.9 C8.- 32.51,88.9 32.51,84.07 27.56,79.12 v25.4,79.12 18.29,79.12 5.33,66.17 5.33,22.61 11.43,19.05 Q8.C
L8-2
  Bottom 0.508: 19.05,24.64 23.62,24.64 IC8.OUT | 30.73,88.9 30.73,84.84 30.48,84.58 D8.C 30.48,84.84 26.42,80.77 17.78,80.77 4.32,67.31 4.32,10.92 10.67,7.11 16,7.11 19.05,10.16 19.05,24.64 | 30.73,88.9 30.73,97.03 L8.2 | 30.73,88.9 C8.+ | 19.05,24.64 C27.2
L9-1  (via drill 0.7)
  Top 0.508: v22.86,82.55 22.86,76.96 20.32,74.42 D9.A
  Bottom 0.508: 22.61,88.9 22.61,94.49 25.15,97.03 L9.1 | Q9.C 12.19,64.77 12.19,66.04 20.32,74.17 D9.A | 22.61,88.9 22.61,82.8 v22.86,82.55 | 22.61,88.9 C9.-
L9-2
  Bottom 0.508: 20.57,87.63 20.57,84.84 20.32,84.58 D9.C | 20.57,87.63 20.57,88.9 | 20.57,88.9 20.57,97.03 L9.2 | 20.57,88.9 C9.+ | 20.57,87.63 C9.+ | C29.2 6.35,82.55 IC9.OUT 8.89,85.6 12.19,88.9 C9.+
M4-1  (via drill 0.7)
  Top 0.508: v59.82,23.62 61.21,23.62 64.26,20.57 69.85,20.57 73.15,23.88 73.15,27.18 75.82,29.84 79.38,29.84 80.26,30.73 80.26,41.78 v81.41,42.93 | v87.88,62.48 v91.44,58.93
  Bottom 0.508: M4.1 86.11,97.03 86.11,88.39 84.84,87.12 C10.- 84.58,86.87 83.82,86.87 80.64,83.69 | 80.64,83.69 80.52,83.57 80.26,83.57 78.49,81.79 78.49,73.41 81.28,70.61 D10.A | v81.41,42.93 83.82,42.93 88.14,47.24 90.93,47.24 91.95,48.26 91.95,58.42 v91.44,58.93 | v87.88,62.48 87.88,64.77 89.15,66.04 89.15,75.18 80.64,83.69 | Q10.D 56.52,29.21 59.69,26.04 59.69,23.75 v59.82,23.62
M4-2  (via drill 0.7)
  Top 0.508: C31.2 63.5,31.75 64.14,32.38 66.67,32.38 73.03,38.73 73.03,41.27 76.83,45.09 81.28,45.09 81.92,45.72 81.92,48.9 v81.79,49.02 | v78.49,84.33 78.49,83.44 D10.C
  Bottom 0.508: 81.28,87.12 81.28,97.03 M4.2 | 81.28,87.12 v78.49,84.33 | 81.28,87.12 C10.+ | v81.79,49.02 83.57,50.8 83.57,61.98 88.14,66.55 88.14,73.66 81.28,80.52 D10.C | IC10.OUT 65.41,31.11 C31.2
M5-1  (via drill 0.7)
  Top 0.508: v20.45,65.15 v24.38,61.85 | 60.96,70.36 D11.A 59.56,69.09 v24.38,69.09 | v31.24,40.64 v31.24,36.2
  Bottom 0.508: M5.1 65.79,97.03 65.79,88.39 64.52,87.12 C11.- 64.26,86.87 64.26,73.91 60.96,70.61 D11.A | v24.38,61.85 29.72,57.78 29.72,42.16 v31.24,40.64 | v24.38,69.09 v20.45,65.15 | Q11.D 33.66,29.21 31.11,31.75 31.11,35.43 v31.24,36.2
M5-2  (via drill 0.7)
  Top 0.508: v38.1,41.4 41.15,38.35 41.15,31.75 C33.2
  Bottom 0.508: M5.2 60.96,97.03 C11.+ D11.C 60.96,80.52 51.82,71.37 34.29,71.37 31.5,68.58 31.5,48.01 v38.1,41.4 | IC11.OUT C33.2
MISO  (via drill 0.7)
  Top 0.508: B1.50 93.98,27.94 94.61,28.57 111.12,28.57 v113.03,26.67
  Bottom 0.508: v113.03,26.67 113.03,19.05 115.57,16.51 SV1.6
MOSI
  Top 0.508: SV1.3 99.06,24.13 B1.51
N$1  (via drill 0.7)
  Top 0.508: R10.P$2 52.07,53.34 v52.07,35.56
  Bottom 0.508: Q10.G 52.7,31.75 52.07,32.38 v52.07,35.56
N$2
  Bottom 0.508: MIDI_OUT.2 44.45,12.7 R15.P$2
N$3
  Bottom 0.508: R2.P$2 55.88,53.59 65.28,44.83 70.74,44.83 Q2.B
N$4  (via drill 0.7)
  Top 0.508: R3.P$2 58.67,54.36 58.67,40.26 60.58,38.35 v68.83,38.35
  Bottom 0.508: v68.83,38.35 71.75,35.43 71.75,31.11 75.56,27.3 Q3.B
N$5
  Bottom 0.508: Q4.B 55.88,52.07 R4.P$2
N$8  (via drill 0.7)
  Top 0.508: R5.P$2 v41.91,54.61
  Bottom 0.508: v41.91,54.61 Q5.B
N$10  (via drill 0.7)
  Top 0.508: v43.43,38.35 43.43,49.78 R11.P$2
  Bottom 0.508: Q11.G 36.83,34.92 37.47,35.56 41.27,35.56 43.43,37.72 v43.43,38.35
N$13  (via drill 0.7)
  Top 0.508: v17.53,56.39 36.07,56.39 37.59,57.91 43.94,57.91 R6.P$2
  Bottom 0.508: v17.53,56.39 12.7,51.56 Q6.B
N$14  (via drill 0.7)
  Top 0.508: v19.56,51.56 24.38,51.56 28.19,55.37 v37.59,55.37
  Bottom 0.508: Q7.B 11.43,41.91 18.03,48.51 18.03,50.04 v19.56,51.56 | R7.P$2 v37.59,55.37
N$15  (via drill 0.7)
  Top 0.508: v26.16,58.17 36.32,58.17 37.85,59.69 R8.P$2
  Bottom 0.508: v26.16,58.17 21.34,53.34 21.34,45.72 14.73,39.12 14.73,21.59 Q8.B
N$16
  Bottom 0.508: R1.P$2 70.36,59.69 75.95,54.1 77.47,54.1 Q1.B
N$17  (via drill 0.7)
  Top 0.508: R9.P$2 22.23,67.31 19.05,70.48 13.46,70.48 v13.21,70.23
  Bottom 0.508: v13.21,70.23 13.08,70.23 9.53,66.67 Q9.B
N$25  (via drill 0.7)
  Top 0.508: v138.18,18.29 134.37,22.1 134.37,43.43 D12.A
  Bottom 0.508: OK1.3 123.19,51.69 125.35,49.53 D12.A | v138.18,18.29 138.18,3.81 MIDI_IN.3
N$26
  Top 0.508: D12.C R12.P$1
  Bottom 0.508: D12.C OK1.2
N$27  (via drill 0.7)
  Top 0.508: v133.35,19.3 133.35,41.91 R12.P$2
  Bottom 0.508: v133.35,19.3 MIDI_IN.2
N$29
  Bottom 0.508: R14.P$1 OK1.7
P2
  Top 0.508: B1.2 R1.P$1
P3
  Top 0.508: B1.3 R2.P$1
P4
  Top 0.508: B1.4 R3.P$1
P5
  Top 0.508: B1.5 R10.P$1 R4.P$1
P6
  Top 0.508: B1.6 R11.P$1 R5.P$1
P7
  Top 0.508: B1.7 R6.P$1
P8
  Top 0.508: B1.8 R7.P$1
P9
  Top 0.508: B1.9 R8.P$1
P10
  Top 0.508: B1.10 R9.P$1
PRX  (via drill 0.7)
  Top 0.508: v119.89,68.07 95.76,68.07 94.74,69.09 88.14,69.09 R13.P$2
  Bottom 0.508: OK1.6 123.19,64.77 v119.89,68.07 | B1.0 71.63,64.77 75.69,68.83 80.52,68.83 82.04,67.31 R13.P$2
PTX  (via drill 0.7)
  Top 0.508: v66.04,61.47 63.75,59.18 63.75,44.96 68.58,40.13 v70.61,40.13 | v60.2,3.81 62.23,3.81 68.58,10.16 77.47,10.16 79.38,12.06 79.38,27.43 v79.76,27.81
  Bottom 0.508: v60.2,3.81 49.53,3.81 MIDI_OUT.3 | v66.04,61.47 64.26,61.47 B1.1 | v70.61,40.13 73.03,37.72 73.03,31.75 76.96,27.81 v79.76,27.81
S1  (via drill 0.7)
  Top 0.508: v128.02,60.96 126.49,59.44 99.31,59.44 B1.23
  Bottom 0.508: v128.02,60.96 130.3,63.25 137.16,63.25 S1.3
S2  (via drill 0.7)
  Top 0.508: v127.51,57.91 98.3,57.91 B1.25
  Bottom 0.508: v127.51,57.91 137.16,48.26 S2.3
S3  (via drill 0.7)
  Top 0.508: B1.27 v120.65,33.02
  Bottom 0.508: v120.65,33.02 137.16,33.02 S3.3
SCK
  Top 0.508: SV1.5 93.98,19.05 92.2,20.83 92.2,22.35 B1.52
SS
  Top 0.508: SV1.4 99.06,21.59 B1.53

### Text on the board
Top: LOA | LEGBA r1 | MIDI OUT | PWR | MIDI IN